# EAGLE schematic memoryboard2 (EAGLE 7.3.0)
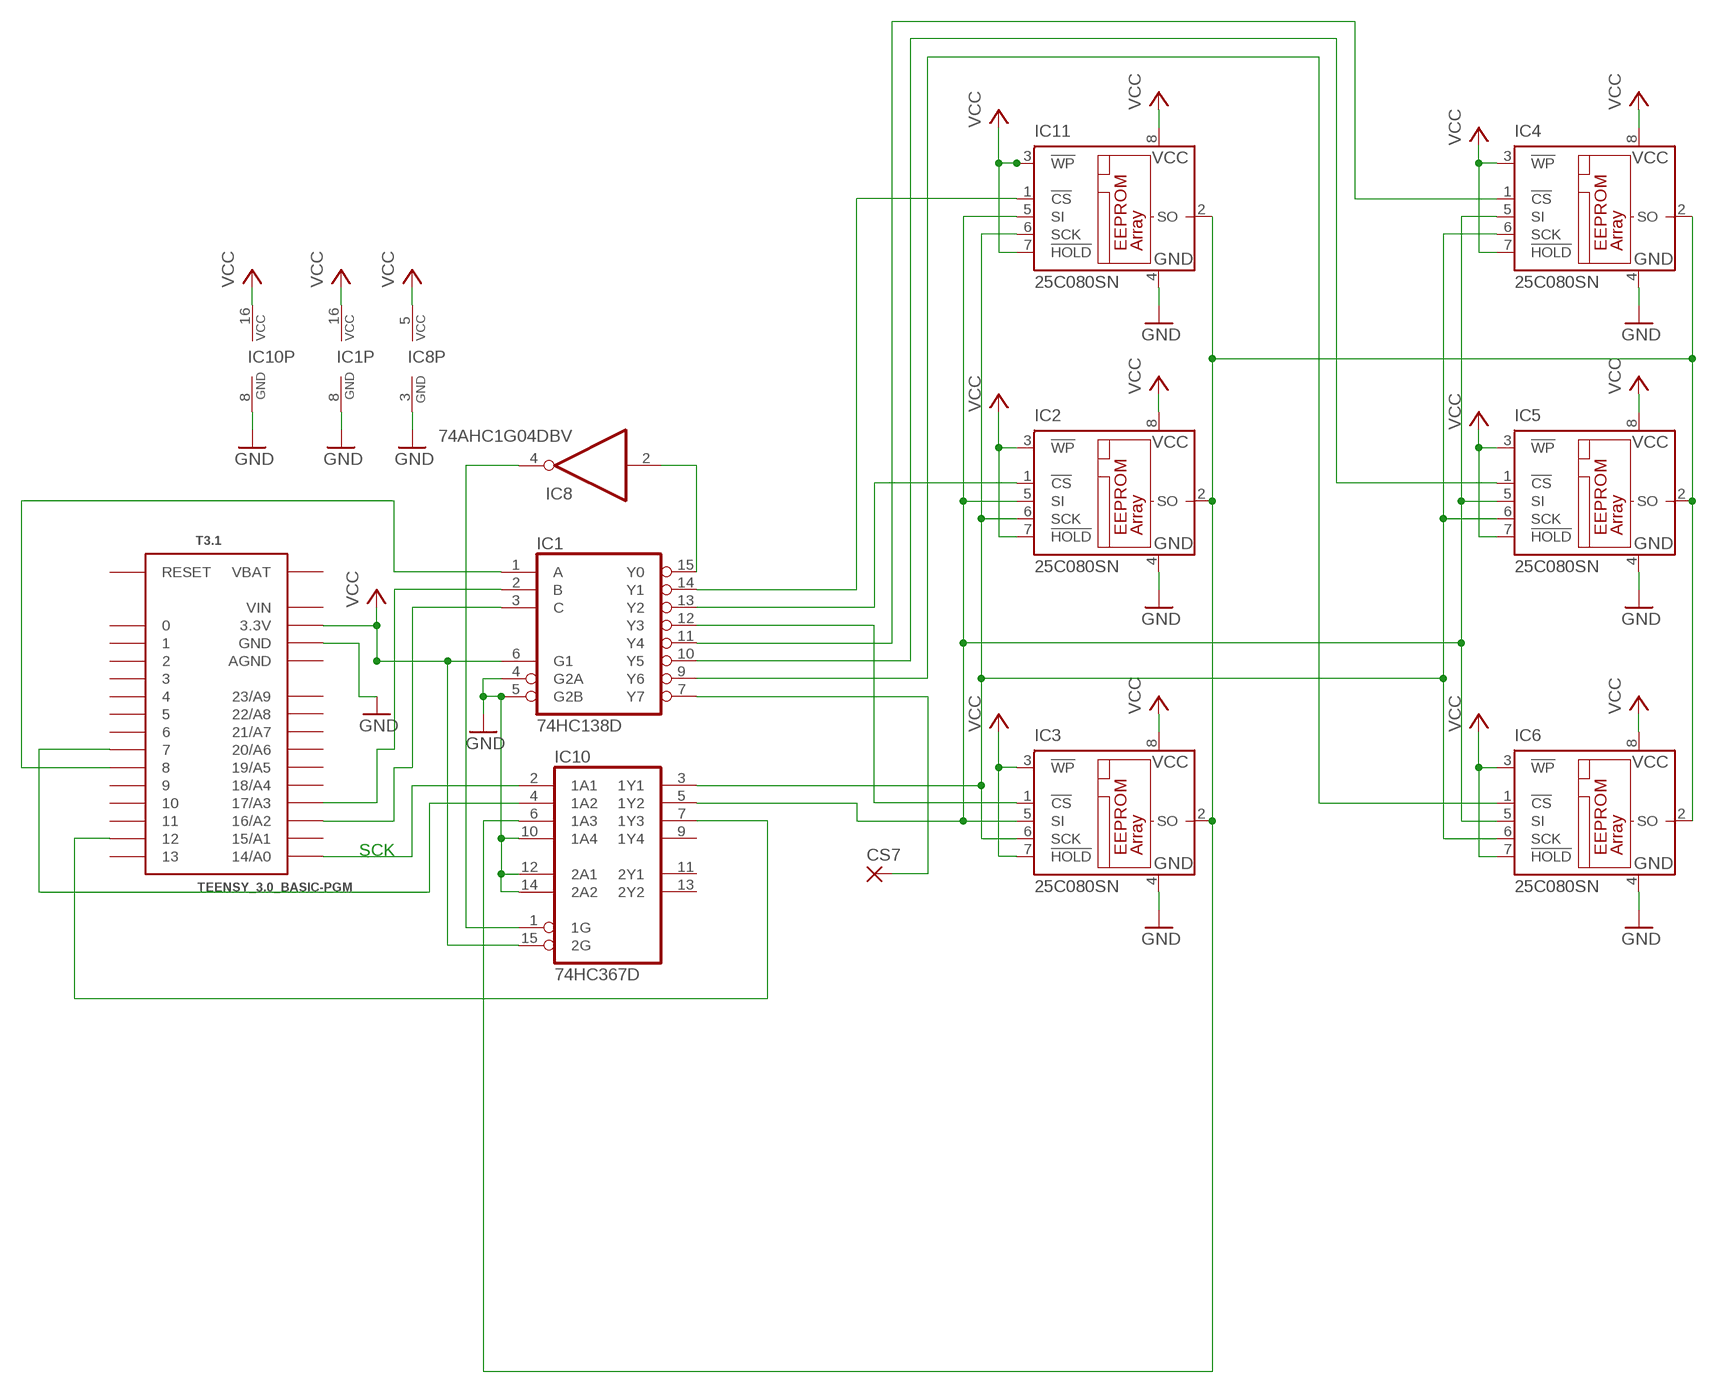
[diagram p0: schematic, sheet 1]

## Parts
CS7  SMD2  [SMD1,27-2,54]
IC1  74HC138D  [SO16]
IC2  25C080SN  [SO-08]
IC3  25C080SN  [SO-08]
IC4  25C080SN  [SO-08]
IC5  25C080SN  [SO-08]
IC6  25C080SN  [SO-08]
IC8  74AHC1G04DBV  [SOT23-5]
IC10  74HC367D  [SO16]
IC11  25C080SN  [SO-08]
T3.1  TEENSY_3.0_BASIC-PGM  [TEENSY_3.0_BASIC-PGM]

## Nets
GND: IC1.4(G2A) IC1.5(G2B) IC1.8(GND) IC2.4(GND) IC3.4(GND) IC4.4(GND) IC5.4(GND) IC6.4(GND) IC8.3(GND) IC10.8(GND) IC10.10(1A4) IC10.12(2A1) IC10.14(2A2) IC11.4(GND) T3.1.GND T3.1.GND1(GND)
N$1: IC8.4(O) IC10.1(1G)
N$2: IC10.2(1A1) T3.1.14/A0
N$3: IC10.4(1A2) T3.1.7
N$4: IC10.7(1Y3) T3.1.12
N$5: IC1.15(Y0) IC8.2(I)
N$6: IC1.3(C) T3.1.16/A2
N$7: CS7.1(P) IC1.7(Y7)
N$9: IC1.10(Y5) IC5.1(!CS)
N$10: IC2.6(SCK) IC3.6(SCK) IC4.6(SCK) IC5.6(SCK) IC6.6(SCK) IC10.3(1Y1) IC11.6(SCK)
N$11: IC1.2(B) T3.1.17/A3
N$12: IC1.9(Y6) IC6.1(!CS)
N$13: IC1.12(Y3) IC3.1(!CS)
N$14: IC2.2(SO) IC3.2(SO) IC4.2(SO) IC5.2(SO) IC6.2(SO) IC10.6(1A3) IC11.2(SO)
N$15: IC1.11(Y4) IC4.1(!CS)
N$16: IC1.1(A) T3.1.8
N$17: IC2.5(SI) IC3.5(SI) IC4.5(SI) IC5.5(SI) IC6.5(SI) IC10.5(1Y2) IC11.5(SI)
N$29: IC1.14(Y1) IC11.1(!CS)
N$30: IC1.13(Y2) IC2.1(!CS)
VCC: IC1.6(G1) IC1.16(VCC) IC2.3(!WP) IC2.7(!HOLD) IC2.8(VCC) IC3.3(!WP) IC3.7(!HOLD) IC3.8(VCC) IC4.3(!WP) IC4.7(!HOLD) IC4.8(VCC) IC5.3(!WP) IC5.7(!HOLD) IC5.8(VCC) IC6.3(!WP) IC6.7(!HOLD) IC6.8(VCC) IC8.5(VCC) IC10.15(2G) IC10.16(VCC) IC11.3(!WP) IC11.7(!HOLD) IC11.8(VCC) T3.1.3.3V T3.1.3.3V1(3.3V)
Unconnected: IC10.9(1Y4) IC10.11(2Y1) IC10.13(2Y2) T3.1.0 T3.1.1 T3.1.2 T3.1.3 T3.1.4 T3.1.5 T3.1.6 T3.1.9 T3.1.10 T3.1.11 T3.1.13 T3.1.15/A1 T3.1.18/A4 T3.1.19/A5 T3.1.20/A6 T3.1.21/A7 T3.1.22/A8 T3.1.23/A9 T3.1.RESET

## Notes on the sheet
- SCK

## Power pins joined to a net without a drawn wire
AGND: T3.1.AGND
VBAT: T3.1.VBAT
VIN: T3.1.VIN

## Library data of the parts
CS7 = wirepad:SMD2: SMD PAD
IC1 = 74xx-eu:74*138: 3-line to 8-line DECODER/DEMULTIPLEXER
IC2-IC6 IC11 = microchip:25*: Serial EEPROM 4K/ 8K , SPI bus; MF: MICROCHIP; MPN: 25C080/SN; OC_FARNELL: unknown; OC_NEWARK: 96K4086
IC8 = 74xx-little-us:74*1G04: INVERTER Gate
IC10 = 74xx-eu:74*367: Hex BUS DRIVER, 3-state
T3.1 = Teensy3.0:TEENSY_3.0_BASIC-PGM: Teensy 3.0 Board outline identical to other 'basic' version except that 'PGM' pin has been omitted. See '+4', 'AllAnalogPins", and 'AllPins' packages for additional pin holes, as needed.